# EAGLE schematic ARM-OB (EAGLE 6.5.0)
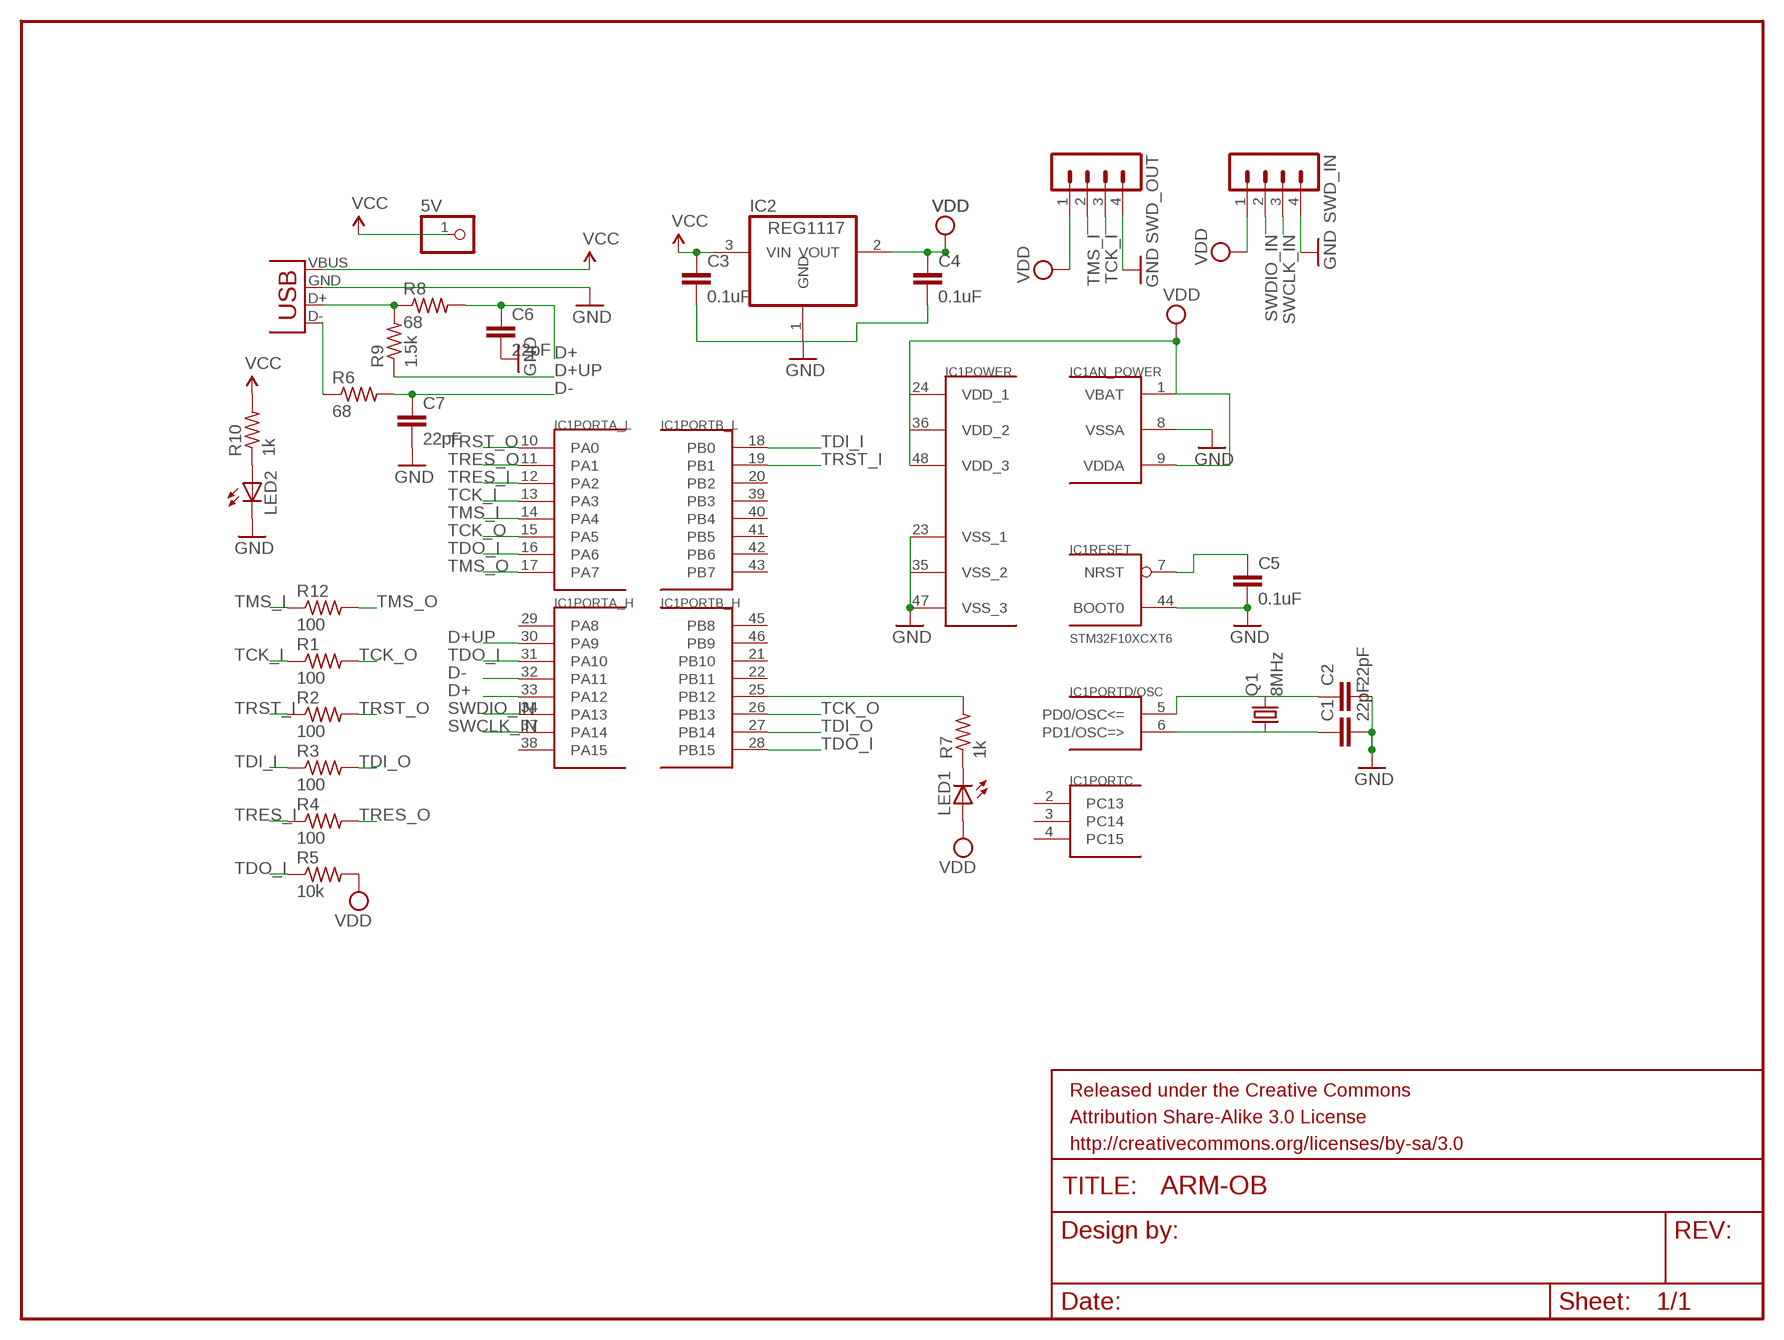
[diagram p0: schematic, sheet 1]

## Parts
5V  PINHD-1X1  [1X01]
C1  22pF  C-EU050-025X075  [C050-025X075]
C2  22pF  C-EU050-025X075  [C050-025X075]
C3  0.1uF  C-EU050-025X075  [C050-025X075]
C4  0.1uF  C-EU050-025X075  [C050-025X075]
C5  0.1uF  C-EU050-025X075  [C050-025X075]
C6  22pF  C-EU050-025X075  [C050-025X075]
C7  22pF  C-EU050-025X075  [C050-025X075]
FRAME1  FRAME-LETTER  [CREATIVE_COMMONS]
IC1  STM32F10XCXT6  [TQFP48]
IC2  REG1117  [SOT223]
LED1  LEDSML0805  [SML0805]
LED2  LEDSML0805  [SML0805]
Q1  8MHz  CRYSTALHC49UP  [HC49UP]
R1  100  R-US_0204/7  [0204/7]
R2  100  R-US_0204/7  [0204/7]
R3  100  R-US_0204/7  [0204/7]
R4  100  R-US_0204/7  [0204/7]
R5  10k  R-US_0204/7  [0204/7]
R6  68  R-US_0204/7  [0204/7]
R7  1k  R-US_0204/7  [0204/7]
R8  68  R-US_0204/7  [0204/7]
R9  1.5k  R-US_0204/7  [0204/7]
R10  1k  R-US_0204/7  [0204/7]
R12  100  R-US_0204/7  [0204/7]
SWD_IN  MA04-1  [MA04-1]
SWD_OUT  MA04-1  [MA04-1]
USB  USB-A-H  [USB-A-H]

## Nets
D+: C6.1 IC1.33(PORTA_H:PA12) R8.2
D+UP: IC1.30(PORTA_H:PA9) R9.1
D-: C7.1 IC1.32(PORTA_H:PA11) R6.2
GND: C1.2 C2.2 C3.2 C4.2 C5.2 C6.2 C7.2 IC1.8(AN_POWER:VSSA) IC1.23(POWER:VSS_1) IC1.35(POWER:VSS_2) IC1.44(RESET:BOOT0) IC1.47(POWER:VSS_3) IC2.1(GND) LED2.C SWD_IN.4 SWD_OUT.4 USB.GND(VBUS)
N$1: C5.1 IC1.7(RESET:NRST)
N$2: R8.1 R9.2 USB.D+(D-)
N$3: IC1.25(PORTB_H:PB12) R7.2
N$4: R6.1 USB.D-(D+)
N$5: C2.1 IC1.5(PORTD/OSC:PD0/OSC<=) Q1.2
N$6: C1.1 IC1.6(PORTD/OSC:PD1/OSC=>) Q1.1
N$7: LED2.A R10.1
N$8: LED1.C R7.1
SWCLK_IN: IC1.37(PORTA_H:PA14) SWD_IN.3
SWDIO_IN: IC1.34(PORTA_H:PA13) SWD_IN.2
TCK_I: IC1.13(PORTA_L:PA3) R1.1 SWD_OUT.3
TCK_O: IC1.15(PORTA_L:PA5) IC1.26(PORTB_H:PB13) R1.2
TDI_I: IC1.18(PORTB_L:PB0) R3.1
TDI_O: IC1.27(PORTB_H:PB14) R3.2
TDO_I: IC1.16(PORTA_L:PA6) IC1.28(PORTB_H:PB15) IC1.31(PORTA_H:PA10) R5.1
TMS_I: IC1.14(PORTA_L:PA4) R12.1 SWD_OUT.2
TMS_O: IC1.17(PORTA_L:PA7) R12.2
TRES_I: IC1.12(PORTA_L:PA2) R4.1
TRES_O: IC1.11(PORTA_L:PA1) R4.2
TRST_I: IC1.19(PORTB_L:PB1) R2.1
TRST_O: IC1.10(PORTA_L:PA0) R2.2
VCC: 5V.1 C3.1 IC2.3(VIN) R10.2 USB.VBUS(GND)
VDD: C4.1 IC1.1(AN_POWER:VBAT) IC1.9(AN_POWER:VDDA) IC1.24(POWER:VDD_1) IC1.36(POWER:VDD_2) IC1.48(POWER:VDD_3) IC2.2(VOUT) LED1.A R5.2 SWD_IN.1 SWD_OUT.1
Unconnected: IC1.2(PORTC:PC13) IC1.3(PORTC:PC14) IC1.4(PORTC:PC15) IC1.20(PORTB_L:PB2) IC1.21(PORTB_H:PB10) IC1.22(PORTB_H:PB11) IC1.29(PORTA_H:PA8) IC1.38(PORTA_H:PA15) IC1.39(PORTB_L:PB3) IC1.40(PORTB_L:PB4) IC1.41(PORTB_L:PB5) IC1.42(PORTB_L:PB6) IC1.43(PORTB_L:PB7) IC1.45(PORTB_H:PB8) IC1.46(PORTB_H:PB9)

## Library data of the parts
5V = pinhead:PINHD-1X1: PIN HEADER
C1-C7 = resistor:C-EU: CAPACITOR, European symbol
FRAME1 = SparkFun-Aesthetics:FRAME-LETTER: Schematic Frame Standard 8.5x11 US Letter frame
IC1 = stm32:STM32F10XCXT6: ST STM32F101/103 48pin LQFP
IC2 = burr-brown:REG1117: 800mA and 1A Low Dropout (LDO) Positive Regulator 1.8V, 2.5V, 2.85V, 3.3V, 5V, and Adj; MPN: REG1117; OC_FARNELL: 1097566; OC_NEWARK: 14P6981
LED1 LED2 = led:LED: LED OSRAM: - CHIPLED LG R971, LG N971, LY N971, LG Q971, LY Q971, LO R971, LY R971 LH N974, LH R974 LS Q976, LO Q976, LY Q976 LO Q996 - Hyper CHIPLED LW Q18S LB Q993, LB Q99A, LB R99A - SideLED LS A670, LO A670, LY A670, LG A670, LP A670 LB A673, LV A673, LT A673, LW A673 LH A674 LY A675 LS A676, LA A676, LO A676, LY A676, LW A676 LS A679, LY A679, LG A679 - Hyper Micro SIDELED® LS Y876, LA Y876, LO Y876, LY Y876 LT Y87S - SmartLED LW L88C, LW L88S LB L89C, LB L89S, LG L890 LS L89K, LO L89K, LY L89K LS L896, LA L896, LO L896, LY L896 - TOPLED LS T670, LO T670, LY T670, LG T670, LP T670 LSG T670, LSP T670, LSY T670, LOP T670, LYG T670 LG T671, LOG T671, LSG T671 LB T673, LV T673, LT T673, LW T673 LH T674 LS T676, LA T676, LO T676, LY T676, LB T676, LH T676, LSB T676, LW T676 LB T67C, LV T67C, LT T67C, LS T67K, LO T67K, LY T67K, LW E67C LS E67B, LA E67B, LO E67B, LY E67B, LB E67C, LV E67C, LT E67C LW T67C LS T679, LY T679, LG T679 LS T770, LO T770, LY T770, LG T770, LP T770 LB T773, LV T773, LT T773, LW T773 LH T774 LS E675, LA E675, LY E675, LS T675 LS T776, LA T776, LO T776, LY T776, LB T776 LHGB T686 LT T68C, LB T68C - Hyper Mini TOPLED® LB M676 - Mini TOPLED Santana® LG M470 LS M47K, LO M47K, LY M47K Source: http://www.osram.convergy.de LUXEON: - LUMILED® LXK2-PW12-R00, LXK2-PW12-S00, LXK2-PW14-U00, LXK2-PW14-V00 LXK2-PM12-R00, LXK2-PM12-S00, LXK2-PM14-U00 LXK2-PE12-Q00, LXK2-PE12-R00, LXK2-PE12-S00, LXK2-PE14-T00, LXK2-PE14-U00 LXK2-PB12-K00, LXK2-PB12-L00, LXK2-PB12-M00, LXK2-PB14-N00, LXK2-PB14-P00, LXK2-PB14-Q00 LXK2-PR12-L00, LXK2-PR12-M00, LXK2-PR14-Q00, LXK2-PR14-R00 LXK2-PD12-Q00, LXK2-PD12-R00, LXK2-PD12-S00 LXK2-PH12-R00, LXK2-PH12-S00 LXK2-PL12-P00, LXK2-PL12-Q00, LXK2-PL12-R00 Source: www.luxeon.com KINGBRIGHT: KA-3528ASYC Source: www.kingbright.com
Q1 = adafruit:CRYSTAL: CRYSTAL; OC_FARNELL: unknown; OC_NEWARK: unknown
R1-R10 R12 = resistor:R-US_: RESISTOR, American symbol
SWD_IN SWD_OUT = con-lstb:MA04-1: PIN HEADER; OC_FARNELL: unknown; OC_NEWARK: unknown
USB = SparkFun-Connectors:USB: USB Connectors USB-B-PTH is fully proven SKU : PRT-00139/CONN-08278 USB-miniB is fully proven SKU : PRT-00587 USB-A-PCB is untested. USB-A-H is throughly reviewed, but untested. Spark Fun Electronics SKU : PRT-00437 USB-B-SMT is throughly reviewed, but untested. Needs silkscreen touching up. USB-A-S has not been used/tested USB-MB-H has not been used/tested USB-MICROB has been used. CONN-09505